# EAGLE schematic expansion_board (EAGLE 7.5.0)
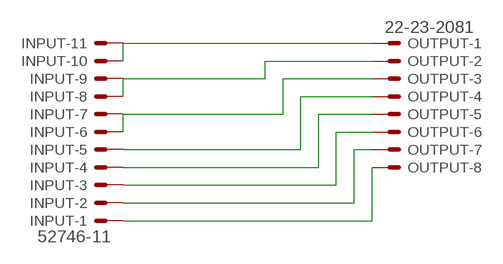
[diagram p0: schematic, sheet 1]

## Parts
INPUT  52746-11  [52746-11]
OUTPUT  22-23-2081  [22-23-2081]

## Nets
N$1: INPUT.1 OUTPUT.8
N$2: INPUT.2 OUTPUT.7
N$3: INPUT.3 OUTPUT.6
N$4: INPUT.4 OUTPUT.5
N$5: INPUT.5 OUTPUT.4
N$6: INPUT.6 INPUT.7 OUTPUT.3
N$7: INPUT.8 INPUT.9 OUTPUT.2
N$8: INPUT.10 INPUT.11 OUTPUT.1

## Library data of the parts
INPUT = con-molex:52746-11: FPC Connector ZIF for SMT 0.5mm Source: http://www.farnell.com/datasheets/73044.pdf [DWG. NO. (Sheet 1 OF 2) SD-52746-**17]; OC_FARNELL: unknown; OC_NEWARK: unknown
OUTPUT = con-molex:22-23-2081: .100" (2.54mm) Center Header - 8 Pin; MF: MOLEX; MPN: 22-23-2081; OC_FARNELL: 1756826; OC_NEWARK: 01C7592